# EAGLE design RHD2132_lvds_headstage_50mil (EAGLE 6.4)
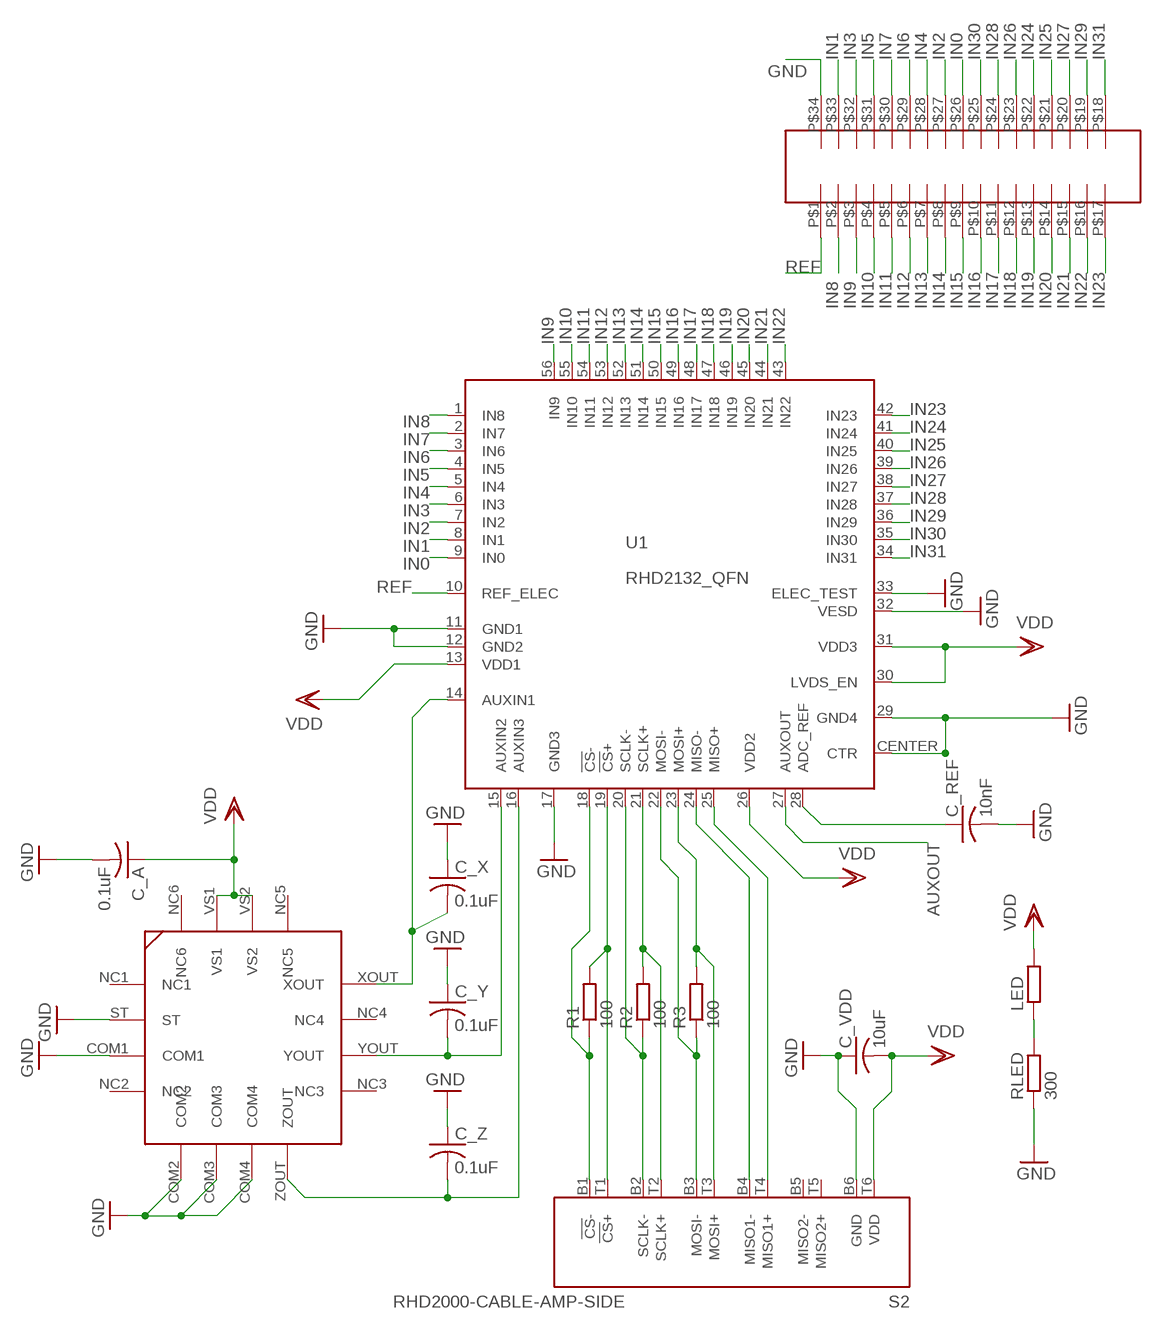
[diagram p0: schematic, sheet 1]

## Parts
C_A  0.1uF  C-USC0402K  [C0402K]
C_REF  10nF  C-USC0402K  [C0402K]
C_VDD  10uF  C-USC0402K  [C0402K]
C_X  0.1uF  C-USC0402K  [C0402K]
C_Y  0.1uF  C-USC0402K  [C0402K]
C_Z  0.1uF  C-USC0402K  [C0402K]
LED  R-EU_R0402  [R0402]
R1  100  R-EU_R0402  [R0402]
R2  100  R-EU_R0402  [R0402]
R3  100  R-EU_R0402  [R0402]
RLED  300  R-EU_R0402  [R0402]
S2  RHD2000-CABLE-AMP-SIDE  [OMNETICS_PZN-12-AA]
U1  RHD2132_QFN  [QFN56_8_X_8_LARGE]
U$1  ADXL335  [ADXL335]
U$2  MILL-MAX17X2  [MILL-MAX17X2SMD]

## Nets
ADC_REF: C_REF.1 U1.28(ADC_REF)
AUXOUT: U1.27(AUXOUT)
CS+: R1.2 S2.T1(!CS!+) U1.19(!CS!+)
CS-: R1.1 S2.B1(!CS!-) U1.18(!CS!-)
GND: C_A.2 C_REF.2 C_VDD.1 C_X.1 C_Y.1 C_Z.1 RLED.1 S2.B6(GND) U1.11(GND1) U1.12(GND2) U1.17(GND3) U1.29(GND4) U1.32(VESD) U1.33(ELEC_TEST) U1.CENTER(CTR) U$1.COM1 U$1.COM2 U$1.COM3 U$1.COM4 U$1.ST U$2.P$34
IN0: U1.9(IN0) U$2.P$26
IN1: U1.8(IN1) U$2.P$33
IN2: U1.7(IN2) U$2.P$27
IN3: U1.6(IN3) U$2.P$32
IN4: U1.5(IN4) U$2.P$28
IN5: U1.4(IN5) U$2.P$31
IN6: U1.3(IN6) U$2.P$29
IN7: U1.2(IN7) U$2.P$30
IN8: U1.1(IN8) U$2.P$2
IN9: U1.56(IN9) U$2.P$3
IN10: U1.55(IN10) U$2.P$4
IN11: U1.54(IN11) U$2.P$5
IN12: U1.53(IN12) U$2.P$6
IN13: U1.52(IN13) U$2.P$7
IN14: U1.51(IN14) U$2.P$8
IN15: U1.50(IN15) U$2.P$9
IN16: U1.49(IN16) U$2.P$10
IN17: U1.48(IN17) U$2.P$11
IN18: U1.47(IN18) U$2.P$12
IN19: U1.46(IN19) U$2.P$13
IN20: U1.45(IN20) U$2.P$14
IN21: U1.44(IN21) U$2.P$15
IN22: U1.43(IN22) U$2.P$16
IN23: U1.42(IN23) U$2.P$17
IN24: U1.41(IN24) U$2.P$22
IN25: U1.40(IN25) U$2.P$21
IN26: U1.39(IN26) U$2.P$23
IN27: U1.38(IN27) U$2.P$20
IN28: U1.37(IN28) U$2.P$24
IN29: U1.36(IN29) U$2.P$19
IN30: U1.35(IN30) U$2.P$25
IN31: U1.34(IN31) U$2.P$18
LEDOUT: LED.1 RLED.2
MISO1+: S2.T4(MISO1+) U1.25(MISO+)
MISO1-: S2.B4(MISO1-) U1.24(MISO-)
MOSI+: R3.2 S2.T3(MOSI+) U1.23(MOSI+)
MOSI-: R3.1 S2.B3(MOSI-) U1.22(MOSI-)
REF: U1.10(REF_ELEC) U$2.P$1
SCLK+: R2.2 S2.T2(SCLK+) U1.21(SCLK+)
SCLK-: R2.1 S2.B2(SCLK-) U1.20(SCLK-)
VDD: C_A.1 C_VDD.2 LED.2 S2.T6(VDD) U1.13(VDD1) U1.26(VDD2) U1.30(LVDS_EN) U1.31(VDD3) U$1.VS1 U$1.VS2
XOUT: C_X.2 U1.14(AUXIN1) U$1.XOUT
YOUT: C_Y.2 U1.15(AUXIN2) U$1.YOUT
ZOUT: C_Z.2 U1.16(AUXIN3) U$1.ZOUT
Unconnected: S2.B5(MISO2-) S2.T5(MISO2+) U$1.NC1 U$1.NC2 U$1.NC3 U$1.NC4 U$1.NC5 U$1.NC6

## Library data of the parts
C_A C_REF C_VDD C_X C_Y C_Z = resistor:C-US: CAPACITOR, American symbol
LED R1-R3 RLED = resistor:R-EU_: RESISTOR, European symbol
S2 = RHD2000:RHD2000-CABLE-AMP-SIDE
U1 = RHD2000:RHD2132
U$1 = voigts:ADXL335: The ADXL335 is a small, thin, low power, complete 3-axis accelerometer with signal conditioned voltage outputs. The product measures acceleration with a minimum full-scale range of ±3 g. It can measure the static acceleration of gravity in tilt-sensing applications, as well as dynamic acceleration resulting from motion, shock, or vibration. The user selects the bandwidth of the accelerometer using the CX, CY, and CZ capacitors at the XOUT, YOUT, and ZOUT pins. Bandwidths can be selected to suit the application, with a range of 0.5 Hz to 1600 Hz for the X and Y axes, and a range of 0.5 Hz to 550 Hz for the Z axi
U$2 = caleb:MILL-MAX17X2

## Board
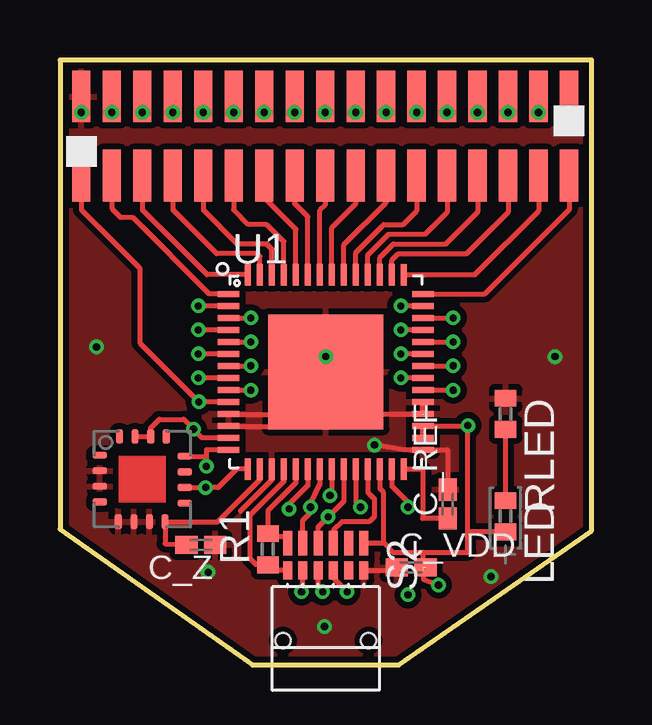
[diagram p1: board, top side]
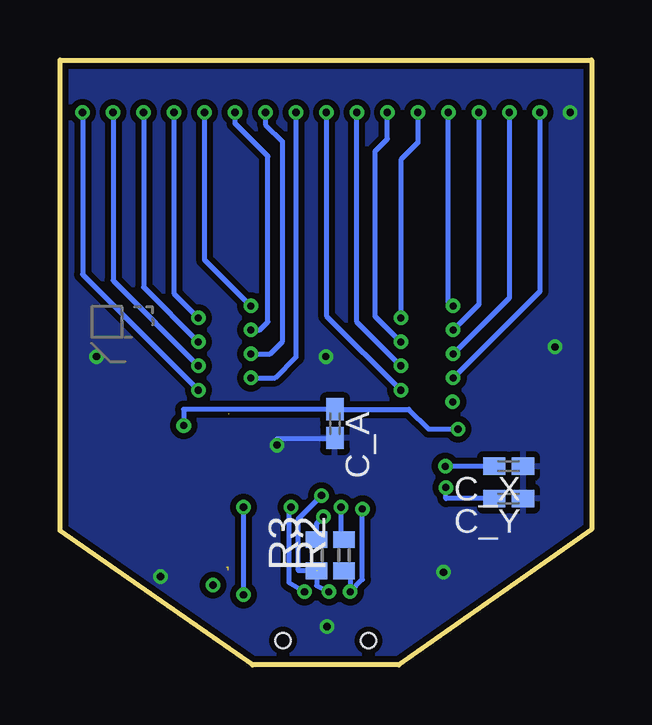
[diagram p2: board, bottom side, seen from below]

Size 22.15 x 25.22 mm. Coordinates in mm from the lower left corner, seen from the top.
Outline: 0,25.22 0,5.65 8.03,0 14.12,0 22.15,5.59 22.15,25.22 0,25.22
Copper layers (1*16): Top 0.035mm / dielectric 1.5mm / Bottom 0.035mm
Design rules "Fusion_eagle_rule_v1.1 *": minimum track width 6mil, minimum drill 0.3mm, track to track 6mil, track to pad 6mil, pad to pad 6mil, via to via 6mil, smd to smd 0mil, copper to edge 10mil, drill to drill 10mil, minimum pad ring 10mil, minimum via ring 6mil, stop-mask expansion 2mil, vias tented up to drill 100mil, thermal gap 10mil
Holes 0.64 mm at 9.3,1.02 12.85,1.02

### Footprints (pad centres in the part's own frame; a part is rotated, then mirrored left to right if it is on the bottom)
C0402K = smd 0.925 x 0.74: 1 -0.6,0; 2 0.6,0
R0402 = smd 0.7 x 0.9: 1 -0.65,0; 2 0.65,0
OMNETICS_PZN-12-AA = smd 0.381 x 0.762: B1 1.587,-1.016; B2 0.953,-1.016; B3 0.318,-1.016; B4 -0.318,-1.016; B5 -0.953,-1.016; B6 -1.587,-1.016 | smd 0.381 x 1.016: T1 1.587,-2.159; T2 0.953,-2.159; T3 0.318,-2.159; T4 -0.318,-2.159; T5 -0.953,-2.159; T6 -1.587,-2.159
QFN56_8_X_8_LARGE = smd 0.9 x 0.25: 1 -4.05,3.25; 2 -4.05,2.75; 3 -4.05,2.25; 4 -4.05,1.75; 5 -4.05,1.25; 6 -4.05,0.75; 7 -4.05,0.25; 8 -4.05,-0.25; 9 -4.05,-0.75; 10 -4.05,-1.25; 11 -4.05,-1.75; 12 -4.05,-2.25; 13 -4.05,-2.75; 14 -4.05,-3.25; 29 4.05,-3.25; 30 4.05,-2.75; 31 4.05,-2.25; 32 4.05,-1.75; 33 4.05,-1.25; 34 4.05,-0.75; 35 4.05,-0.25; 36 4.05,0.25; 37 4.05,0.75; 38 4.05,1.25; 39 4.05,1.75; 40 4.05,2.25; 41 4.05,2.75; 42 4.05,3.25 | smd 0.25 x 0.9: 15 -3.25,-4.05; 16 -2.75,-4.05; 17 -2.25,-4.05; 18 -1.75,-4.05; 19 -1.25,-4.05; 20 -0.75,-4.05; 21 -0.25,-4.05; 22 0.25,-4.05; 23 0.75,-4.05; 24 1.25,-4.05; 25 1.75,-4.05; 26 2.25,-4.05; 27 2.75,-4.05; 28 3.25,-4.05; 43 3.25,4.05; 44 2.75,4.05; 45 2.25,4.05; 46 1.75,4.05; 47 1.25,4.05; 48 0.75,4.05; 49 0.25,4.05; 50 -0.25,4.05; 51 -0.75,4.05; 52 -1.25,4.05; 53 -1.75,4.05; 54 -2.25,4.05; 55 -2.75,4.05; 56 -3.25,4.05 | smd 4.8 x 4.8: CENTER 0,0
ADXL335 = smd 0.61 x 0.305: COM1 -1.775,-0.3; NC1 -1.775,1; NC2 -1.775,-0.95; NC3 1.775,-1; NC4 1.775,0.3; ST -1.775,0.35; XOUT 1.775,0.95; YOUT 1.775,-0.35 | smd 0.305 x 0.61: COM2 -1,-1.775; COM3 -0.35,-1.775; COM4 0.3,-1.775; NC5 1,1.775; NC6 -0.95,1.775; VS1 0.35,1.775; VS2 -0.3,1.775; ZOUT 0.95,-1.775
MILL-MAX17X2SMD = smd 2.159 x 0.762: P$1 -1.651,10.16; P$2 -1.651,8.89; P$3 -1.651,7.62; P$4 -1.651,6.35; P$5 -1.651,5.08; P$6 -1.651,3.81; P$7 -1.651,2.54; P$8 -1.651,1.27; P$9 -1.651,0; P$10 -1.651,-1.27; P$11 -1.651,-2.54; P$12 -1.651,-3.81; P$13 -1.651,-5.08; P$14 -1.651,-6.35; P$15 -1.651,-7.62; P$16 -1.651,-8.89; P$17 -1.651,-10.16; P$18 1.651,-10.16; P$19 1.651,-8.89; P$20 1.651,-7.62; P$21 1.651,-6.35; P$22 1.651,-5.08; P$23 1.651,-3.81; P$24 1.651,-2.54; P$25 1.651,-1.27; P$26 1.651,0; P$27 1.651,1.27; P$28 1.651,2.54; P$29 1.651,3.81; P$30 1.651,5.08; P$31 1.651,6.35; P$32 1.651,7.62; P$33 1.651,8.89; P$34 1.651,10.16

### Placement (x,y rotation side)
C_A  10.69,10.06 270 bottom
C_REF  16.15,6.71 90 top
C_VDD  14.63,4.06 0 top
C_X  3.45,8.28 180 bottom
C_Y  3.45,6.93 180 bottom
C_Z  5.87,5 180 top
LED  18.57,6.2 270 top
R1  8.66,4.83 90 top
R2  10.31,4.57 90 bottom
R3  11.46,4.57 90 bottom
RLED  18.57,10.46 270 top
S2  11.07,2.92 180 top
U1  11.07,12.22 0 top
U$1  3.43,7.75 0 top
U$2  11.05,22.05 90 top

### Tracks (layer width: path | path; a pad name or v marks a point on that pad's centre or on a via)
ADC_REF
  Top 0.203: U1.28 15.11,8.17 15.11,6.11 C_REF.1
AUXOUT  (via drill 0.3)
  Top 0.203: U1.27 13.82,7.46 14.5,6.78 v14.5,6.58
  Bottom 0.203: v14.5,6.58 v14.5,2.92
CS+
  Top 0.203: U1.19 9.82,7.59 8.66,6.43 R1.2 8.66,5.33 9.42,5.33 9.49,5.27 S2.T1
CS-
  Top 0.203: U1.18 9.32,7.65 7.9,6.22 7.9,4.45 8.17,4.18 R1.1 8.9,3.94 S2.B1
GND  (via drill 0.3)  (1 unrouted)
  Top 0.203: 12.73,3.94 13.74,3.94 | 7.01,10.44 9.3,10.44 | 7.01,9.93 9.04,9.93 9.55,10.44 9.3,10.44 | 9.3,10.44 11.07,11.71 | 15.14,10.44 13.11,10.44 12.98,10.31 | U1.17 8.82,7.71 7.52,6.4 | C_REF.2 16.15,8.97 U1.29 14.32,8.97 v13.11,9.17 | U1.32 U1.33 | U$2.P$34 v0.89,23.04
  Bottom 0.203: v13.11,9.17 13.11,9.42 10.69,9.42 10.69,9.55
  other vias: 11.02,1.6 17.96,3.68 11.07,12.85 6.17,3.86 1.52,13.26 20.62,12.85
  pour Top (isolate 0.254): 0.13,5.78 7.95,-0.15 14.3,-0.2 22.02,5.71 22.02,25.27 0.13,25.27
  pour Bottom (isolate 0.254): 0.2,25.16 0.08,9.22 0.08,5.61 8.05,-0.13 14.15,-0.13 22.02,5.51 22.02,10.85 21.92,25.17
IN0  (via drill 0.3)
  Top 0.203: v7.95,11.46 6.88,11.46 6.9,11.47 U1.9 | U$2.P$26 v11.05,23.04
  Bottom 0.203: v11.05,23.04 11.05,14.55 v7.95,11.46
IN1  (via drill 0.3)
  Top 0.203: U1.8 v5.77,11.97 | U$2.P$33 v2.16,23.04
  Bottom 0.203: v2.16,23.04 2.16,15.57 v5.77,11.97
IN2  (via drill 0.3)
  Top 0.203: 6.76,12.47 U1.7 | U1.7 v7.95,12.47 | U1.7 | U$2.P$27 v9.78,23.04
  Bottom 0.203: v7.95,12.47 9.78,14.3 v9.78,23.04
IN3  (via drill 0.3)
  Top 0.203: U1.6 v5.77,12.97 | U$2.P$32 v3.43,23.04
  Bottom 0.203: v3.43,23.04 3.43,15.3 v5.77,12.97
IN4  (via drill 0.3)
  Top 0.203: U1.5 v7.95,13.47 | U$2.P$28 v8.51,23.04
  Bottom 0.203: v7.95,13.47 9.02,14.53 9.02,21.41 8.51,21.92 v8.51,23.04
IN5  (via drill 0.3)
  Top 0.203: U1.4 v5.77,13.97 | U$2.P$31 v4.7,23.04
  Bottom 0.203: v4.7,23.04 4.7,15.03 v5.77,13.97
IN6  (via drill 0.3)
  Top 0.203: U1.3 v7.95,14.47 | U$2.P$29 v7.24,23.04
  Bottom 0.203: v7.24,23.04 7.24,21.77 7.95,21.06 v7.95,14.47
IN7  (via drill 0.3)
  Top 0.203: U1.2 v5.77,14.97 | U$2.P$30 v5.97,23.04
  Bottom 0.203: v5.77,14.97 5.82,14.97 5.97,15.11 v5.97,23.04
IN8
  Top 0.203: U1.1 6.22,15.47 3.02,18.67 2.51,18.67 2.16,19.02 U$2.P$2
IN9
  Top 0.203: U$2.P$3 3.43,18.97 6.14,16.27 U1.56
IN10
  Top 0.203: U1.55 8.32,17.02 8.2,17.15 6.53,17.15 4.7,18.97 U$2.P$4
IN11
  Top 0.203: U$2.P$5 5.97,18.97 7.39,17.55 8.61,17.55 8.82,17.34 U1.54
IN12
  Top 0.203: U1.53 9.32,17.65 8.61,18.36 7.85,18.36 7.24,18.97 U$2.P$6
IN13
  Top 0.203: U1.52 9.82,18.17 8.51,19.48 U$2.P$7
IN14
  Top 0.203: U1.51 10.32,18.68 9.78,19.23 U$2.P$8
IN15
  Top 0.203: U1.50 10.82,18.95 11.05,19.18 U$2.P$9
IN16
  Top 0.203: U1.49 11.32,18.23 12.32,19.23 U$2.P$10
IN17
  Top 0.203: U1.48 11.82,17.51 13.59,19.28 U$2.P$11
IN18
  Top 0.203: U1.47 12.32,17.2 13.49,18.36 14.3,18.36 14.86,18.92 U$2.P$12
IN19
  Top 0.203: U$2.P$13 16.13,18.87 15.21,17.96 13.69,17.96 12.82,17.09 U1.46
IN20
  Top 0.203: U1.45 13.32,16.98 13.89,17.55 16.08,17.55 17.4,18.87 U$2.P$14
IN21
  Top 0.203: U1.44 13.82,16.87 14.1,17.15 16.94,17.15 18.67,18.87 U$2.P$15
IN22
  Top 0.203: U$2.P$16 19.94,18.92 17.28,16.27 U1.43
IN23
  Top 0.203: U$2.P$17 21.21,18.97 17.7,15.47 U1.42
IN24  (via drill 0.3)
  Top 0.203: U1.41 v14.2,14.97 | U$2.P$22 v16.13,23.04
  Bottom 0.203: v16.13,23.04 16.13,16.9 v14.2,14.97
IN25  (via drill 0.3)
  Top 0.203: U1.40 v16.38,14.47 | U$2.P$21 v17.4,23.04
  Bottom 0.203: v17.4,23.04 17.4,15.48 v16.38,14.47
IN26  (via drill 0.3)
  Top 0.203: U1.39 v14.2,13.97 | U$2.P$23 v14.86,23.04
  Bottom 0.203: v14.86,23.04 14.86,22.58 13.49,21.21 13.49,14.3 13.82,13.97 v14.2,13.97
IN27  (via drill 0.3)
  Top 0.203: U1.38 v16.38,13.47 | U$2.P$20 v18.67,23.04
  Bottom 0.203: v18.67,23.04 18.67,15.75 v16.38,13.47
IN28  (via drill 0.3)
  Top 0.203: U1.37 v14.2,12.97 | U$2.P$24 v13.59,23.04
  Bottom 0.203: v13.59,23.04 13.59,22.53 12.88,21.82 12.88,13.49 13.4,12.97 v14.2,12.97
IN29  (via drill 0.3)
  Top 0.203: v16.38,12.47 U1.36 | U$2.P$19 v19.94,23.04
  Bottom 0.203: v19.94,23.04 19.94,16.03 v16.38,12.47
IN30  (via drill 0.3)
  Top 0.203: 15.39,11.96 U1.35 | U1.35 v14.2,11.96 | U1.35 | U$2.P$25 v12.32,23.04
  Bottom 0.203: v12.32,23.04 12.32,12.83 13.18,11.96 v14.2,11.96
IN31  (via drill 0.3)
  Top 0.203: v16.38,11.46 15.14,11.46 U1.34 | U$2.P$18 v21.21,23.04
  Bottom 0.203: v21.21,23.04 21.21,16.28 v16.38,11.46
LEDOUT
  Top 0.203: LED.1 RLED.2
MISO1+
  Top 0.203: S2.T4 11.39,5.6 11.76,5.97 12.88,5.97 13.11,6.2 13.11,6.91 12.82,7.19 U1.25
MISO1-  (via drill 0.3)
  Top 0.203: U1.24 12.32,6.78 v12.52,6.58 | v11.96,3.05 11.39,3.62 S2.B4
  Bottom 0.203: v11.96,3.05 12.6,3.43 12.6,6.5 v12.52,6.58
MOSI+  (via drill 0.3)
  Top 0.203: S2.T3 10.76,5.75 v11.18,6.17 11.82,6.82 U1.23
  Bottom 0.203: R3.2 11.46,5.89 v11.18,6.17
MOSI-  (via drill 0.3)  (1 unrouted)
  Top 0.203: U1.22 11.32,7.13 v11.25,7.06 | v10.95,3.05 10.76,3.24 S2.B3
  Bottom 0.203: v10.95,3.05 11.46,3.3 11.46,3.94 12.22,3.94 12.22,6.1 v11.25,7.06
REF  (via drill 0.3)
  Top 0.203: U$2.P$1 0.89,18.97 3.33,16.54 3.33,13.43 v5.79,10.97 U1.10
SCLK+  (via drill 0.3)
  Top 0.203: U1.21 10.82,7.52 10.44,6.73 v10.44,6.58 10.44,6.35 10.12,6.03 S2.T2
  Bottom 0.203: v10.44,6.58 10.44,5.35 R2.2
SCLK-  (via drill 0.3)
  Top 0.203: U1.20 10.32,7.48 9.55,6.71 v9.55,6.5 | v10.06,3.05 10.12,3.11 S2.B2
  Bottom 0.203: v9.55,6.5 9.55,3.56 v10.06,3.05 10.06,3.67 R2.1
VDD  (via drill 0.3)  (2 unrouted)
  Top 0.203: S2.T6 13.49,5.08 | 13.49,5.08 13.87,4.7 15.14,4.7 | 15.14,4.06 15.14,4.7 | 16.99,5.55 v16.99,9.98 16.99,9.97 U1.31 U1.30 | 15.14,3.94 15.14,3.56 v15.77,3.33 | U1.13 5.93,9.47 v5.56,9.83 5.16,10.24 4.14,10.24 3.78,9.88 U$1.VS1 U$1.VS2 | LED.2 16.99,5.55 | 15.14,4.7 16.99,4.7 16.99,5.55 | U1.26 13.32,7.35 13.49,7.19 13.49,5.08
  Bottom 0.203: v5.56,9.83 6.78,9.83 7.61,10.66 C_A.1 16.99,10.66 v16.99,9.98
XOUT  (via drill 0.3)
  Top 0.203: U$1.XOUT 6.1,8.7 v6.1,8.28 6.1,8.97 U1.14
  Bottom 0.203: C_X.2 v6.1,8.28
YOUT  (via drill 0.3)
  Top 0.203: U1.15 7.35,8.17 6.58,7.4 v6.07,7.4 U$1.YOUT
  Bottom 0.203: C_Y.2 6.07,6.93 v6.07,7.4
ZOUT
  Top 0.203: U1.16 8.32,7.71 6.58,5.97 U$1.ZOUT 4.38,5.05 C_Z.2

### Text on the board
tDocu: led
bDocu: 32ch headstage | rev 1.0 samtec | apr 2013 | open-ephys.org | powered by | intan | oe | C_A | C_y,x | r100